# Altium schematic sheet SmartWatch-V2-Power.SchDoc
size A4; DocumentNumber: 3; SheetNumber: 3; SheetTotal: 3
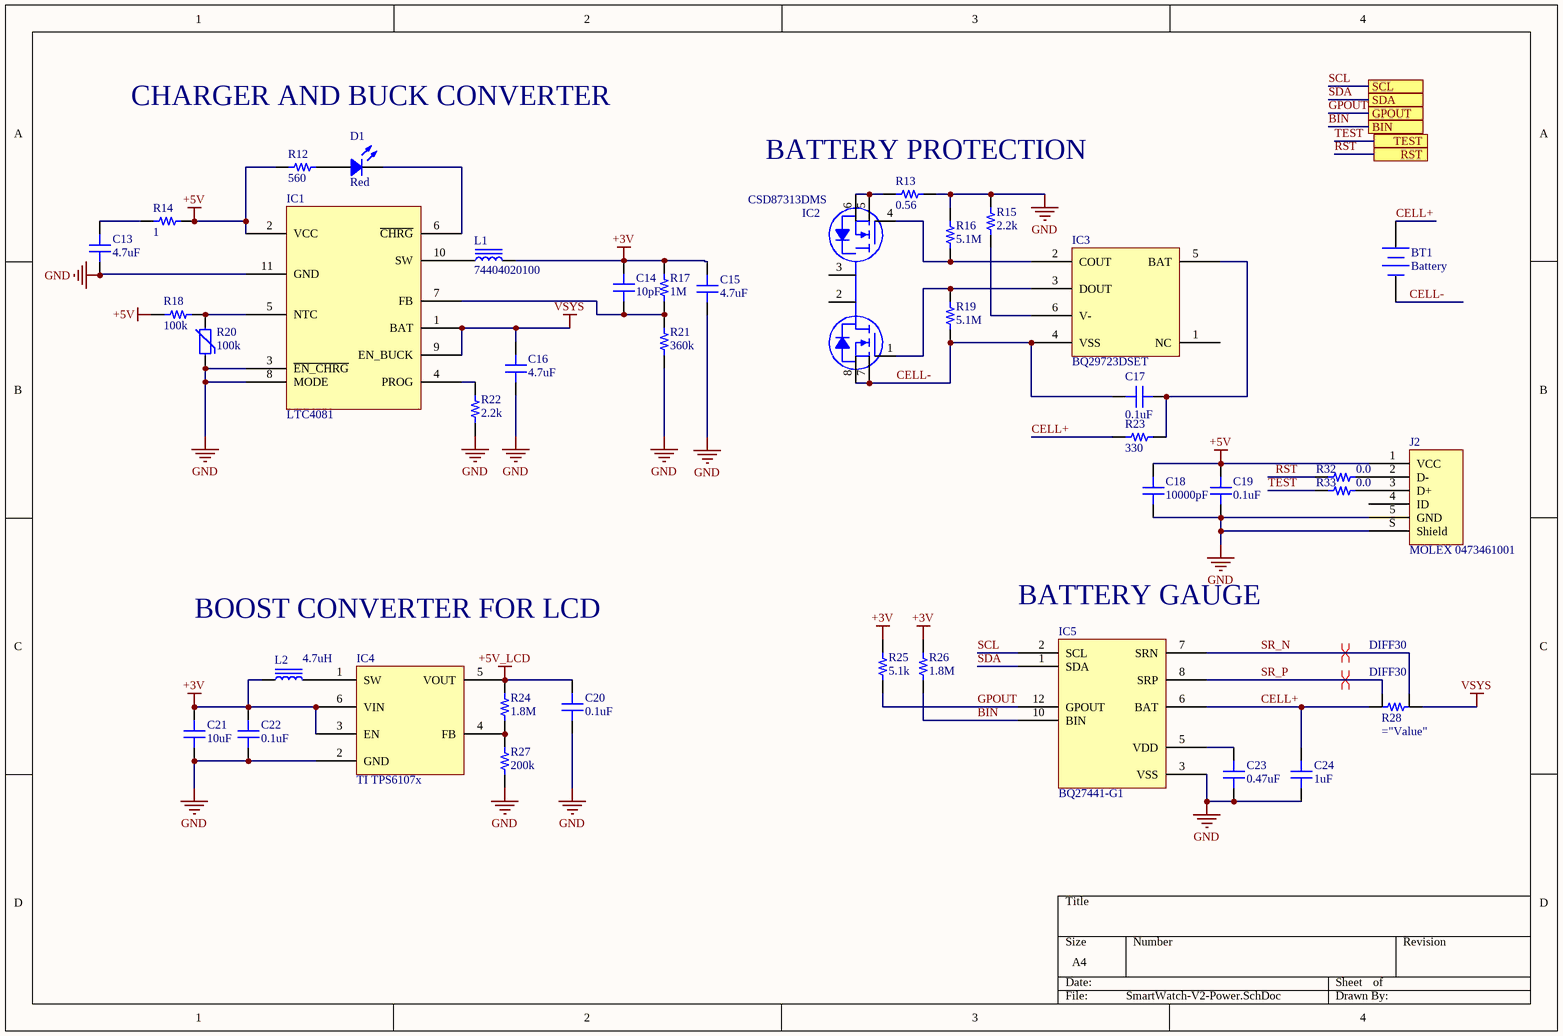
[diagram p0: SmartWatch-V2-Power.SchDoc]

## Parts
BT1  Battery  [BAT-2]
C13  4.7uF  [CAP 0402/1005]
C14  10pF  [CAP 0402/1005]
C15  4.7uF  [CAP 0402/1005]
C16  4.7uF  [CAP 0402/1005]
C17  0.1uF  [CAP 0402/1005]
C18  10000pF  [CAP 0603/1608]
C19  0.1uF  [CAP 0402/1005]
C20  0.1uF  [CAP 0402/1005]
C21  10uF  [CAP 0402/1005]
C22  0.1uF  [CAP 0402/1005]
C23  0.47uF  [CAP 0402/1005]
C24  1uF  [CAP 0402/1005]
D1  Red  [LED 0603/1608 RED]
IC1  LTC4081  [LT DFN-10 3mmx3mm DD]
IC2  CSD87313DMS  [TI WSON-8 3.3x3.3mm]
IC3  BQ29723DSET  [TI WSON-6]
IC4  TI TPS6107x  [TI SOT-23-6 DDC]
IC5  BQ27441-G1  [TI VSON-12 2.5x4mm]
J2  MOLEX 0473461001  [MOLEX 0473461001]
L1  74404020100  [TDK VLS201612CX]
L2  4.7uH  [TDK VLS201612CX]
R12  560  [RES 0402/1005]
R13  0.56  [RES 0603/1608]
R14  1  [RES 0402/1005]
R15  2.2k  [RES 0402/1005]
R16  5.1M  [RES 0402/1005]
R17  1M  [RES 0402/1005]
R18  100k  [RES 0402/1005]
R19  5.1M  [RES 0402/1005]
R20  Resistance in Ohms @ 25C: 100k  [FER 0603/1608]
R21  360k  [RES 0402/1005]
R22  2.2k  [RES 0402/1005]
R23  330  [RES 0402/1005]
R24  1.8M  [RES 0603/1608]
R25  5.1k  [RES 0402/1005]
R26  1.8M  [RES 0402/1005]
R27  200k  [RES 0603/1608]
R28  (no value)  [Current Res CSR1206]  (net tie, no BOM)
R32  0.0  [RES 0603/1608]
R33  0.0  [RES 0603/1608]

## Ports
BIN, GPOUT, RST, SCL, SDA, TEST

## Nets
+3V: C14.2 C15.2 C21.2 C22.2 IC4.3(EN) IC4.6(VIN) L1.2 L2.1 R17.2 R25.2 R26.2
+5V: C18.2 C19.2 IC1.2(VCC) J2.1(VCC) R12.1 R14.2 R18.1
+5V_LCD: C20.2 IC4.5(VOUT) R24.2
GND: C13.1 C15.1 C16.1 C18.1 C19.1 C20.1 C21.1 C22.1 C23.1 C24.1 IC1.3(~{EN_CHRG}) IC1.8(MODE) IC1.11(GND) IC4.2(GND) IC5.3(VSS) J2.5(GND) J2.S(Shield) R13.2 R15.2 R16.2 R20.1 R21.1 R22.1 R27.1
VSYS: C16.2 IC1.1(BAT) IC1.9(EN_BUCK) R28.2
BIN: IC5.10(BIN) R26.1 ; port BIN
CELL+: BT1.1(+) C24.2 IC5.6(BAT) R23.1 R28.1
CELL-: BT1.2(-) C17.1 IC2.7(S1) IC2.8(S2) IC3.4(VSS) R19.1
GPOUT: IC5.12(GPOUT) R25.1 ; port GPOUT
RST: R32.2 ; port RST
SCL: IC5.2(SCL) ; port SCL
SDA: IC5.1(SDA) ; port SDA
SR_N: IC5.7(SRN) R28.4
SR_P: IC5.8(SRP) R28.3
TEST: R33.2 ; port TEST
NetC13_2: C13.2 R14.1
NetC14_1: C14.1 IC1.7(FB) R17.1 R21.2
NetC17_2: C17.2 IC3.5(BAT) R23.2
NetC23_2: C23.2 IC5.5(VDD)
NetD1_1: D1.1 R12.2
NetD1_2: D1.2 IC1.6(~{CHRG})
NetIC1_4: IC1.4(PROG) R22.2
NetIC1_5: IC1.5(NTC) R18.2 R20.2
NetIC1_10: IC1.10(SW) L1.1
NetIC2_1: IC2.1(G1) IC3.3(DOUT) R19.2
NetIC2_4: IC2.4(G2) IC3.2(COUT) R16.1
NetIC2_5: IC2.5(S2) IC2.6(S3) R13.1
NetIC3_6: IC3.6(V-) R15.1
NetIC4_1: IC4.1(SW) L2.2
NetIC4_4: IC4.4(FB) R24.1 R27.2
NetJ2_2: J2.2(D-) R32.1
NetJ2_3: J2.3(D+) R33.1

Not connected (* = marked no-connect by the designer): IC2 2(D) 3(D); IC3 1(NC); IC5 4(NC) 9(NC) 11(NC); J2 4(ID)

## Layout directives
differential pair; net class DIFF30: SR_N, SR_P

## Notes on the sheet
- CHARGER AND BUCK CONVERTER
- BATTERY PROTECTION
- BOOST CONVERTER FOR LCD
- (near IC5) BATTERY GAUGE

## Library data of the parts
BT1 = Battery: Multicell Battery; Published: 24-Mar-1999; LatestRevisionDate: 17-Jul-2002; LatestRevisionNote: Re-released for DXP Platform.; PackageReference: BAT-2; Publisher: Altium Limited; PackageDescription: Battery; 2 Leads
C13 C15 C16 = CC0402MRX5R4BB475: CAP CER 4.7UF 4V X5R 0402; Manufacturer: Yageo; TemperatureRange: -55C ~ 85C; Tolerance: 20%; Value: 4.7uF; Part Number: CC0402MRX5R4BB475; PartId: 12625; Supplier 1: Digi-Key; Supplier Part Number 1: 311-1728-2-ND; ComponentLink1Description: Datasheet; ComponentLink1URL: http://www.yageo.com/documents/recent/UPY-GPHC_X5R_4V-to-50V-21.pdf; ComponentLink2Description: Digi-Key Listing; ComponentLink2URL: https://www.digikey.com/product-detail/en/yageo/CC0402MRX5R4BB475/311-1728-2-ND/5195137; TemperatureCoefficient: X5R; Voltage: 4V; Price: 0,034; Device Package: 0402 (1005 Metric)
C14 = C1005C0G1H100D050BA: CAP CER 10PF 50V C0G 0402; Manufacturer: TDK Corporation; TemperatureRange: -55C ~ 125C; TemperatureCoefficient: C0G, NP0; Tolerance: 0.5pF; Value: 10pF; Part Number: C1005C0G1H100D050BA; PartId: 3878; Supplier 1: Digi-Key; Supplier Part Number 1: 445-1235-2-ND; ComponentLink1Description: Datasheet; ComponentLink1URL: https://product.tdk.com/info/en/catalog/datasheets/mlcc_commercial_general_en.pdf; ComponentLink2Description: Digi-Key listing; ComponentLink2URL: http://digikey.com/product-detail/en/C1005C0G1H100D050BA/445-1235-2-ND/513663; Voltage: 50V; Price: 0,006; Type: -; Device Package: 0402 (1005 Metric)
C17 C19 C20 C22 = C1005X7R1E104K050BB: CAP CER 0.1UF 25V X7R 0402; Manufacturer: TDK Corporation; TemperatureRange: -55C ~ 125C; Tolerance: 10%; Value: 0.1uF; Part Number: C1005X7R1E104K050BB; PartId: 3858; Supplier 1: Digi-Key; Supplier Part Number 1: 445-7348-2-ND; ComponentLink1Description: Datasheet; ComponentLink1URL: https://product.tdk.com/info/en/catalog/datasheets/mlcc_commercial_general_en.pdf; ComponentLink2Description: Digi-Key listing; ComponentLink2URL: http://digikey.com/product-detail/en/C1005X7R1E104K050BB/445-7348-2-ND/2732783; TemperatureCoefficient: X7R; Voltage: 25V; Price: 0,0211; Type: -; Device Package: 0402 (1005 Metric)
C18 = C1608X7R2A103K080AA: CAP CER 10000PF 100V X7R 0603; Manufacturer: TDK Corporation; TemperatureRange: -55C ~ 125C; Tolerance: 10%; Value: 10000pF; Part Number: C1608X7R2A103K080AA; PartId: 4033; Supplier 1: Digi-Key; Supplier Part Number 1: 445-1304-1-ND; ComponentLink1Description: Datasheet; ComponentLink1URL: https://product.tdk.com/info/en/catalog/datasheets/mlcc_commercial_midvoltage_en.pdf; ComponentLink2Description: Digi-Key listing; ComponentLink2URL: http://digikey.com/product-detail/en/C1608X7R2A103K080AA/445-1304-1-ND/567706; TemperatureCoefficient: X7R; Voltage: 100V; Price: 0,14; Type: -; Device Package: 0603 (1608 Metric)
C21 = C1005X5R0J106M050BC: CAP CER 10UF 6.3V X5R 0402; Manufacturer: TDK Corporation; TemperatureRange: -55C ~ 85C; Tolerance: 20%; Value: 10uF; Part Number: C1005X5R0J106M050BC; PartId: 12380; Supplier 1: Digi-Key; Supplier Part Number 1: 445-8920-2-ND; ComponentLink1Description: Datasheet; ComponentLink1URL: https://product.tdk.com/info/en/catalog/datasheets/mlcc_commercial_general_en.pdf; ComponentLink2Description: Digi-Key Listing; ComponentLink2URL: https://www.digikey.com/product-detail/en/tdk-corporation/C1005X5R0J106M050BC/445-8920-2-ND/3507809; TemperatureCoefficient: X5R; Voltage: 6.3V; Price: 0,119; Device Package: 0402 (1005 Metric)
C23 = GRM155R61A474KE15D: CAP CER 0.47UF 10V X5R 0402; Manufacturer: Murata Electronics North America; TemperatureRange: -55C ~ 85C; Tolerance: 10%; Value: 0.47uF; Part Number: GRM155R61A474KE15D; PartId: 12351; Supplier 1: Digi-Key; Supplier Part Number 1: 490-3264-2-ND; ComponentLink1Description: Datasheet; ComponentLink1URL: http://www.murata.com/~/media/webrenewal/support/library/catalog/products/capacitor/mlcc/c02e.pdf; ComponentLink2Description: Digi-Key Listing; ComponentLink2URL: https://www.digikey.com/product-detail/en/murata-electronics-north-america/GRM155R61A474KE15D/490-3264-2-ND/702528; TemperatureCoefficient: X5R; Voltage: 10V; Price: 0,0121; Device Package: 0402 (1005 Metric)
C24 = GRM155R70G105KA12D: CAP CER 1UF 4V X7R 0402; Manufacturer: Murata Electronics North America; TemperatureRange: -55C ~ 125C; Tolerance: 10%; Value: 1uF; Part Number: GRM155R70G105KA12D; PartId: 5154; Supplier 1: Digi-Key; Supplier Part Number 1: 490-7195-2-ND; ComponentLink1Description: Datasheet; ComponentLink1URL: http://www.murata.com/~/media/webrenewal/support/library/catalog/products/capacitor/mlcc/c02e.ashx; ComponentLink2Description: Digi-Key listing; ComponentLink2URL: http://digikey.com/product-detail/en/GRM155R70G105KA12D/490-7195-2-ND/3900466; TemperatureCoefficient: X7R; Voltage: 4V; Price: 0,019; Type: -; Device Package: 0402 (1005 Metric)
D1 = 5975112407F: LED RED DIFFUSED 0603 SMD; Manufacturer: Dialight; Value: Green; Type: Surface Mount; Millicandela: 11.7mcd; Voltage Forward: 1.7V; Current (Test): 20mA; Viewing Angle: 152; Part Number: 5975112407F; PartId: 7057; Supplier 1: Digi-Key; Supplier Part Number 1: 350-2436-2-ND; ComponentLink1Description: Datasheet; ComponentLink1URL: http://www.dialight.com/Assets/Drawings/2D_Drawings_DrawingDetailedSpec/C16413.pdf; ComponentLink2Description: Digi-Key Listing; ComponentLink2URL: http://www.digikey.ca/product-detail/en/5975112407F/350-2436-2-ND/2432587; Price: 0,3092; Device Package: 0603 (1608 Metric); Colour: Red; Lens Transparency: Diffused
IC1 = LTC4081: IC BATTA CHRGR LI-ON with BUCK 10 DFN; Manufacturer: Linear Technology; Part Number: LTC4081; PartId: 16438
IC2 = CSD87313DMS: MOSFET 2 N-CHANNEL 30V 8WSON; Manufacturer: Texas Instruments; Part Number: CSD87313DMS; PartId: 9696
IC3 = BQ29723DSET: IC LITHIUM BATT PROTECT 6WSON; Manufacturer: Texas Instruments; Part Number: BQ29723DSET; PartId: 16440
IC4 = TI TPS6107x: IC REG BOOST ADJ 455MA SYNC SOT6; Manufacturer: Texas Instruments; Part Number: TI TPS6107x; PartId: 16770
IC5 = BQ27441-G1: IC BATT FUEL GAUGE LI-ION 12SON; Manufacturer: Texas Instruments; Part Number: BQ27441-G1; PartId: 16439
J2 = MOLEX 0473461001: CONN USB B SINGLE SMT HORIZ CONNECTOR; Part Number: MOLEX 0473461001; PartId: 9700; Manufacturer: Molex
L1 = VLS201610CX-100M: Manufacturer: TDK Corporation; Value: 10uH; Type: Wirewound; Tolerance: 20%; Current Rating: 710mA; Shielding: Shielded; DC Resistance (DCR): 732 mOhm Max; Part Number: VLS201610CX-100M; PartId: 9403; Supplier 1: Digi-Key; Supplier Part Number 1: 445-172946-2-ND; ComponentLink1Description: Datasheet; ComponentLink1URL: https://product.tdk.com/info/en/catalog/datasheets/inductor_commercial_power_vls201610cx_en.pdf; ComponentLink2Description: Digi-Key Listing; ComponentLink2URL: https://www.digikey.com/product-detail/en/VLS201610CX-100M/445-172946-2-ND/5169751; Price: 0,1549; Device Package: Nonstandard; Series: VLS-CX; Inductance: 10uH; Q @ Freq: -; Frequency - Self Resonant: -; Operating Temperature: -40C ~ 105C
L2 = VLS201612CX-4R7M: FIXED IND 4.7UH 1.12A 252 MOHM; Manufacturer: TDK Corporation; Type: Wirewound; Tolerance: 20%; Shielding: Shielded; DC Resistance (DCR): 252 mOhm Max; Value: 4.7uH; Part Number: VLS201612CX-4R7M; PartId: 9400; Supplier 1: Digi-Key; Supplier Part Number 1: 445-172965-2-ND; ComponentLink1Description: Datasheet; ComponentLink1URL: https://product.tdk.com/info/en/catalog/datasheets/inductor_commercial_power_vls201612cx_en.pdf; ComponentLink2Description: Digi-Key Listing; ComponentLink2URL: https://www.digikey.com/product-detail/en/VLS201612CX-4R7M/445-172965-2-ND/5169770; Price: 0,1549; Device Package: Nonstandard; Series: VLS-CX; Inductance: 4.7uH; Current Rating: 1.12A; Q @ Freq: -; Frequency - Self Resonant: -; Operating Temperature: -40C ~ 105C
R12 = ERA-2APB561X: RES SMD 560 OHM 0.1% 1/16W 0402; Manufacturer: Panasonic Electronic Components; TemperatureRange: -55C ~ 155C; TemperatureCoefficient: 15ppm/C; PowerRating: 0.063W, 1/16W; Value: 560; Part Number: ERA-2APB561X; PartId: 854; Supplier 1: Digi-Key; Supplier Part Number 1: P560CNTR-ND; ComponentLink1Description: Datasheet; ComponentLink1URL: http://industrial.panasonic.com/lecs/www-data/pdf/AOA0000/AOA0000CE26.pdf; ComponentLink2Description: Digikey listing; ComponentLink2URL: http://digikey.com/product-detail/en/ERA-2APB561X/P560CNTR-ND/5140842; Tolerance: 0.1%; Price: 0,3284; Type: Thin Film; Device Package: 0402 (1005 Metric)
R13 = ERJ-3BQJR56V: RES SMD 0.56 OHM 5% 1/4W 0603; Manufacturer: Panasonic Electronic Components; TemperatureRange: -55C ~ 125C; TemperatureCoefficient: 200ppm/C; PowerRating: 0.25W, 1/4W; Value: 0.56; Part Number: ERJ-3BQJR56V; PartId: 11383; Supplier 1: Digi-Key; Supplier Part Number 1: P17441TR-ND; ComponentLink1Description: Datasheet; ComponentLink1URL: https://industrial.panasonic.com/content/data/CC/PDF/news2014/en/AOA0000CE3.pdf; ComponentLink2Description: Digi-Key Listing; ComponentLink2URL: https://www.digikey.com/product-detail/en/panasonic-electronic-components/ERJ-3BQJR56V/P17441TR-ND/5647474; Tolerance: 5%; Price: 0,0301; Device Package: 0603 (1608 Metric)
R14 = RC0402JR-071RL: RES SMD 1 OHM 5% 1/16W 0402; Manufacturer: Yageo; TemperatureRange: -55C ~ 155C; TemperatureCoefficient: 200ppm/C; PowerRating: 0.063W, 1/16W; Value: 1; Part Number: RC0402JR-071RL; PartId: 14504; Supplier 1: Digi-Key; Supplier Part Number 1: 311-1.0JRTR-ND; ComponentLink1Description: Datasheet; ComponentLink1URL: http://www.yageo.com/documents/recent/PYu-RC_Group_51_RoHS_L_04.pdf; ComponentLink2Description: Digi-Key Listing; ComponentLink2URL: https://www.digikey.com/product-detail/en/yageo/RC0402JR-071RL/311-1.0JRTR-ND/726407; Tolerance: 5%; Price: 0,0017; Device Package: 0402 (1005 Metric)
R15 R22 = ERA-2AEB222X: RES SMD 2.2K OHM 0.1% 1/16W 0402; Manufacturer: Panasonic Electronic Components; TemperatureRange: -55C ~ 155C; TemperatureCoefficient: 25ppm/C; PowerRating: 0.063W, 1/16W; Value: 2.2k; Part Number: ERA-2AEB222X; PartId: 671; Supplier 1: Digi-Key; Supplier Part Number 1: P2.2KDCTR-ND; ComponentLink1Description: Datasheet; ComponentLink1URL: http://industrial.panasonic.com/lecs/www-data/pdf/AOA0000/AOA0000CE26.pdf; ComponentLink2Description: Digikey listing; ComponentLink2URL: http://digikey.com/product-detail/en/ERA-2AEB222X/P2.2KDCTR-ND/1706013; Tolerance: 0.1%; Price: 0,0871; Type: Thin Film; Device Package: 0402 (1005 Metric)
R16 R19 = ERJ-2GEJ515X: RES SMD 5.1M OHM 5% 1/10W 0402; Manufacturer: Panasonic Electronic Components; TemperatureRange: -55C ~ 155C; TemperatureCoefficient: -400/ +150ppm/C; PowerRating: 0.1W, 1/10W; Value: 5.1M; Part Number: ERJ-2GEJ515X; PartId: 11092; Supplier 1: Digi-Key; Supplier Part Number 1: P5.1MJTR-ND; ComponentLink1Description: Datasheet; ComponentLink1URL: http://industrial.panasonic.com/www-cgi/jvcr13pz.cgi?E+PZ+3+AOA0001+ERJ2GEJ515X+7+WW; ComponentLink2Description: Digi-Key Listing; ComponentLink2URL: https://www.digikey.com/product-detail/en/panasonic-electronic-components/ERJ-2GEJ515X/P5.1MJTR-ND/282103; Tolerance: 5%; Price: 0,0019; Device Package: 0402 (1005 Metric)
R17 = ERJ-2GEJ105X: RES SMD 1M OHM 5% 1/10W 0402; Manufacturer: Panasonic Electronic Components; TemperatureRange: -55C ~ 155C; TemperatureCoefficient: 200ppm/C; PowerRating: 0.1W, 1/10W; Value: 1M; Part Number: ERJ-2GEJ105X; PartId: 10989; Supplier 1: Digi-Key; Supplier Part Number 1: P1.0MJTR-ND; ComponentLink1Description: Datasheet; ComponentLink1URL: http://industrial.panasonic.com/www-cgi/jvcr13pz.cgi?E+PZ+3+AOA0001+ERJ2GEJ105X+7+WW; ComponentLink2Description: Digi-Key Listing; ComponentLink2URL: https://www.digikey.com/product-detail/en/panasonic-electronic-components/ERJ-2GEJ105X/P1.0MJTR-ND/146900; Tolerance: 5%; Price: 0,0019; Device Package: 0402 (1005 Metric)
R18 = ERA-2AED104X: RES SMD 100K OHM 0.5% 1/16W 0402; Manufacturer: Panasonic Electronic Components; TemperatureRange: -55C ~ 155C; TemperatureCoefficient: 25ppm/C; PowerRating: 0.063W, 1/16W; Value: 100k; Part Number: ERA-2AED104X; PartId: 592; Supplier 1: Digi-Key; Supplier Part Number 1: P100KDETR-ND; ComponentLink1Description: Datasheet; ComponentLink1URL: http://industrial.panasonic.com/lecs/www-data/pdf/AOA0000/AOA0000CE26.pdf; ComponentLink2Description: Digikey listing; ComponentLink2URL: http://digikey.com/product-detail/en/ERA-2AED104X/P100KDETR-ND/1706150; Tolerance: 0.5%; Price: 0,0353; Type: Thin Film; Device Package: 0402 (1005 Metric)
R20 = ABNTC-0603-104J-4250F-T: THERMISTOR NTC 100K OHM 5% 0603; Manufacturer: Abracon LLC; TemperatureRange: -55C ~ 125C; B Value Tolerance: 1%; B25/50: 4250K; Power - Max: 100mW; Value: 100k; Part Number: ABNTC-0603-104J-4250F-T; PartId: 16646; Supplier 1: Digi-Key; Supplier Part Number 1: 535-12851-2-ND; ComponentLink1Description: Datasheet; ComponentLink1URL: http://www.abracon.com/Magnetics/inductors/ABNTC-0603.pdf; ComponentLink2Description: Digi-Key Listing; ComponentLink2URL: https://www.digikey.com/product-detail/en/abracon-llc/ABNTC-0603-104J-4250F-T/535-12851-2-ND/4245602; Price: 0,0799; Resistance Tolerance: 5%; Device Package: 0603 (1608 Metric)
R21 = ERJ-2GEJ364X: RES SMD 360K OHM 5% 1/10W 0402; Manufacturer: Panasonic Electronic Components; TemperatureRange: -55C ~ 155C; TemperatureCoefficient: 200ppm/C; PowerRating: 0.1W, 1/10W; Value: 360k; Part Number: ERJ-2GEJ364X; PartId: 11116; Supplier 1: Digi-Key; Supplier Part Number 1: P360KJTR-ND; ComponentLink1Description: Datasheet; ComponentLink1URL: http://industrial.panasonic.com/www-cgi/jvcr13pz.cgi?E+PZ+3+AOA0001+ERJ2GEJ364X+7+WW; ComponentLink2Description: Digi-Key Listing; ComponentLink2URL: https://www.digikey.com/product-detail/en/panasonic-electronic-components/ERJ-2GEJ364X/P360KJTR-ND/146986; Tolerance: 5%; Price: 0,0019; Device Package: 0402 (1005 Metric)
R23 = ERA-2AED331X: RES SMD 330 OHM 0.5% 1/16W 0402; Manufacturer: Panasonic Electronic Components; TemperatureRange: -55C ~ 155C; TemperatureCoefficient: 25ppm/C; PowerRating: 0.063W, 1/16W; Value: 330; Part Number: ERA-2AED331X; PartId: 598; Supplier 1: Digi-Key; Supplier Part Number 1: P330DETR-ND; ComponentLink1Description: Datasheet; ComponentLink1URL: http://industrial.panasonic.com/lecs/www-data/pdf/AOA0000/AOA0000CE26.pdf; ComponentLink2Description: Digikey listing; ComponentLink2URL: http://digikey.com/product-detail/en/ERA-2AED331X/P330DETR-ND/1706090; Tolerance: 0.5%; Price: 0,0353; Type: Thin Film; Device Package: 0402 (1005 Metric)
R24 = ERJ-3GEYJ185V: RES SMD 1.8M OHM 5% 1/10W 0603; Manufacturer: Panasonic Electronic Components; TemperatureRange: -55C ~ 155C; TemperatureCoefficient: -400/ +150ppm/C; PowerRating: 0.1W, 1/10W; Value: 1.8M; Part Number: ERJ-3GEYJ185V; PartId: 11415; Supplier 1: Digi-Key; Supplier Part Number 1: P1.8MGTR-ND; ComponentLink1Description: Datasheet; ComponentLink1URL: http://industrial.panasonic.com/www-cgi/jvcr13pz.cgi?E+PZ+3+AOA0001+ERJ3GEYJ185V+7+WW; ComponentLink2Description: Digi-Key Listing; ComponentLink2URL: https://www.digikey.com/product-detail/en/panasonic-electronic-components/ERJ-3GEYJ185V/P1.8MGTR-ND/104353; Tolerance: 5%; Price: 0,002; Device Package: 0603 (1608 Metric)
R25 = ERA-2AED512X: RES SMD 5.1K OHM 0.5% 1/16W 0402; Manufacturer: Panasonic Electronic Components; TemperatureRange: -55C ~ 155C; TemperatureCoefficient: 25ppm/C; PowerRating: 0.063W, 1/16W; Value: 5.1k; Part Number: ERA-2AED512X; PartId: 780; Supplier 1: Digi-Key; Supplier Part Number 1: P5.1KDETR-ND; ComponentLink1Description: Datasheet; ComponentLink1URL: http://industrial.panasonic.com/lecs/www-data/pdf/AOA0000/AOA0000CE26.pdf; ComponentLink2Description: Digikey listing; ComponentLink2URL: http://digikey.com/product-detail/en/ERA-2AED512X/P5.1KDETR-ND/1706119; Tolerance: 0.5%; Price: 0,0353; Type: Thin Film; Device Package: 0402 (1005 Metric)
R26 = ERJ-2GEJ185X: RES SMD 1.8M OHM 5% 1/10W 0402; Manufacturer: Panasonic Electronic Components; TemperatureRange: -55C ~ 155C; TemperatureCoefficient: -400/ +150ppm/C; PowerRating: 0.1W, 1/10W; Value: 1.8M; Part Number: ERJ-2GEJ185X; PartId: 11115; Supplier 1: Digi-Key; Supplier Part Number 1: P1.8MJTR-ND; ComponentLink1Description: Datasheet; ComponentLink1URL: http://industrial.panasonic.com/www-cgi/jvcr13pz.cgi?E+PZ+3+AOA0001+ERJ2GEJ185X+7+WW; ComponentLink2Description: Digi-Key Listing; ComponentLink2URL: https://www.digikey.com/product-detail/en/panasonic-electronic-components/ERJ-2GEJ185X/P1.8MJTR-ND/146924; Tolerance: 5%; Price: 0,0019; Device Package: 0402 (1005 Metric)
R27 = ERA-3AEB204V: RES SMD 200K OHM 0.1% 1/10W 0603; Manufacturer: Panasonic Electronic Components; TemperatureRange: -55C ~ 155C; TemperatureCoefficient: 25ppm/C; PowerRating: 0.1W, 1/10W; Value: 200k; Part Number: ERA-3AEB204V; PartId: 1470; Supplier 1: Digi-Key; Supplier Part Number 1: P200KDBTR-ND; ComponentLink1Description: Datasheet; ComponentLink1URL: http://industrial.panasonic.com/lecs/www-data/pdf/AOA0000/AOA0000CE26.pdf; ComponentLink2Description: Digi-Key listing; ComponentLink2URL: http://digikey.com/product-detail/en/ERA-3AEB204V/P200KDBTR-ND/1465909; Tolerance: 0.1%; Price: 0,0653; Type: Thin Film; Device Package: 0603 (1608 Metric)
R28 = Current Resistor: 1206; Part Number: Current Resistor; PartId: 10239
R32 R33 = ERJ-3GEY0R00V: RES SMD 0.0OHM JUMPER 1/10W 0603; Manufacturer: Panasonic Electronic Components; TemperatureRange: -55C ~ 155C; PowerRating: 0.1W, 1/10W; Value: 0.0; Part Number: ERJ-3GEY0R00V; PartId: 16111; Supplier 1: Digi-Key; Supplier Part Number 1: P0.0GTR-ND; ComponentLink1Description: Datasheet; ComponentLink1URL: http://industrial.panasonic.com/www-cgi/jvcr13pz.cgi?E+PZ+3+AOA0001+ERJ3GEY0R00V+7+WW; ComponentLink2Description: Digi-Key Listing; ComponentLink2URL: https://www.digikey.com/product-detail/en/panasonic-electronic-components/ERJ-3GEY0R00V/P0.0GTR-ND/135656; Tolerance: Jumper; Price: 0,0031; Device Package: 0603 (1608 Metric)